# EAGLE design motordriver (EAGLE 7.6.0)
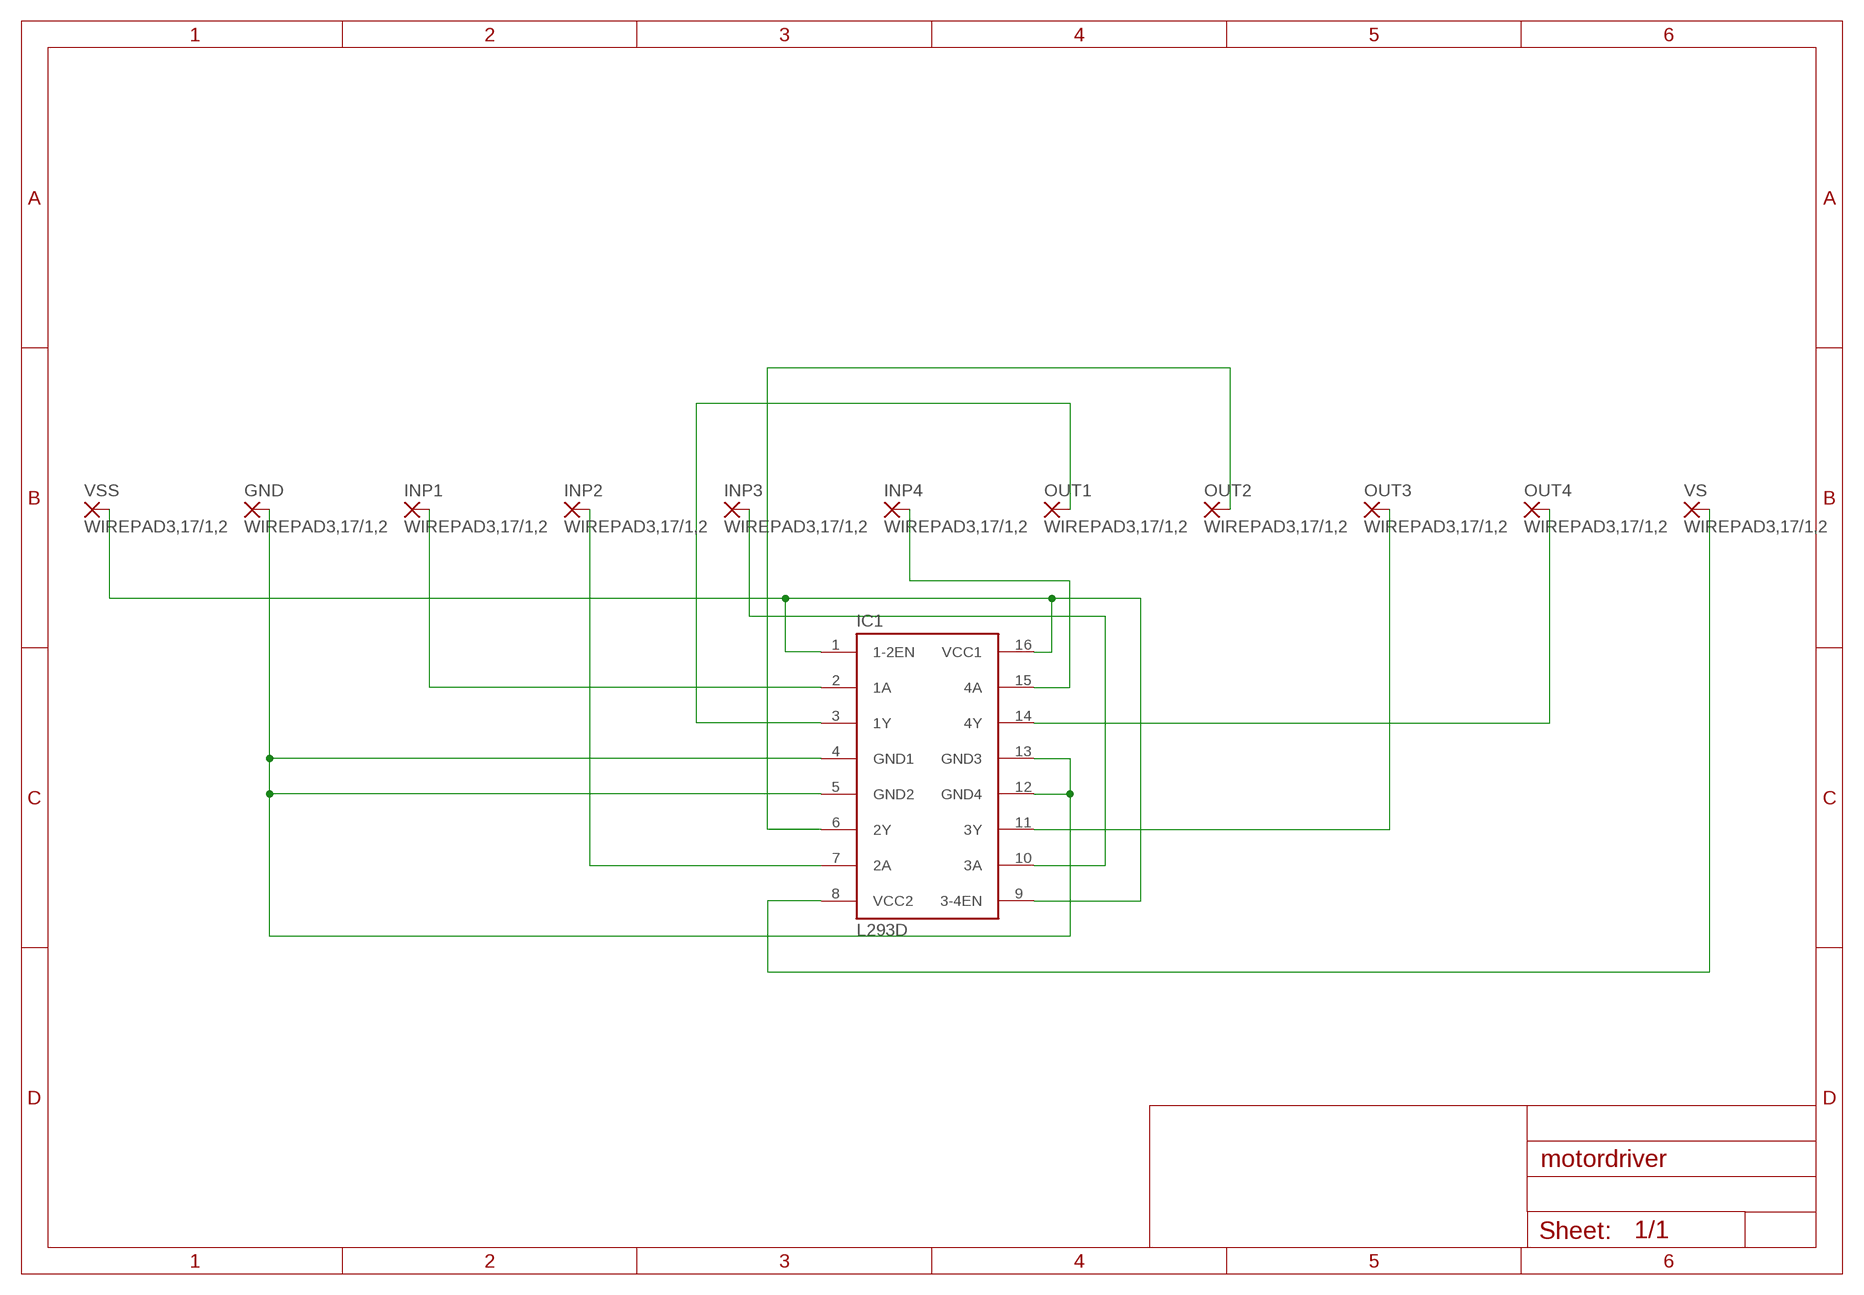
[diagram p0: schematic, sheet 1]

## Parts
GND  WIREPAD3,17/1,2  [3,17/1,2]
IC1  L293D  [DIL16]
INP1  WIREPAD3,17/1,2  [3,17/1,2]
INP2  WIREPAD3,17/1,2  [3,17/1,2]
INP3  WIREPAD3,17/1,2  [3,17/1,2]
INP4  WIREPAD3,17/1,2  [3,17/1,2]
OUT1  WIREPAD3,17/1,2  [3,17/1,2]
OUT2  WIREPAD3,17/1,2  [3,17/1,2]
OUT3  WIREPAD3,17/1,2  [3,17/1,2]
OUT4  WIREPAD3,17/1,2  [3,17/1,2]
VS  WIREPAD3,17/1,2  [3,17/1,2]
VSS  WIREPAD3,17/1,2  [3,17/1,2]

## Nets
N$1: IC1.8(VCC2) VS.1(P)
N$2: IC1.1(1-2EN) IC1.9(3-4EN) IC1.16(VCC1) VSS.1(P)
N$3: IC1.15(4A) INP4.1(P)
N$4: IC1.14(4Y) OUT4.1(P)
N$5: GND.1(P) IC1.4(GND1) IC1.5(GND2) IC1.12(GND4) IC1.13(GND3)
N$6: IC1.11(3Y) OUT3.1(P)
N$7: IC1.10(3A) INP3.1(P)
N$8: IC1.2(1A) INP1.1(P)
N$9: IC1.7(2A) INP2.1(P)
N$10: IC1.3(1Y) OUT1.1(P)
N$11: IC1.6(2Y) OUT2.1(P)

## Library data of the parts
GND INP1-INP4 OUT1-OUT4 VS VSS = wirepad:WIREPAD: Wire PAD connect wire on PCB
IC1 = st-microelectronics:L293D: PUSH-PULL 4 CHANNEL DRIVER; MPN: L293D; OC_FARNELL: 9589619; OC_NEWARK: 56P8249

## Board
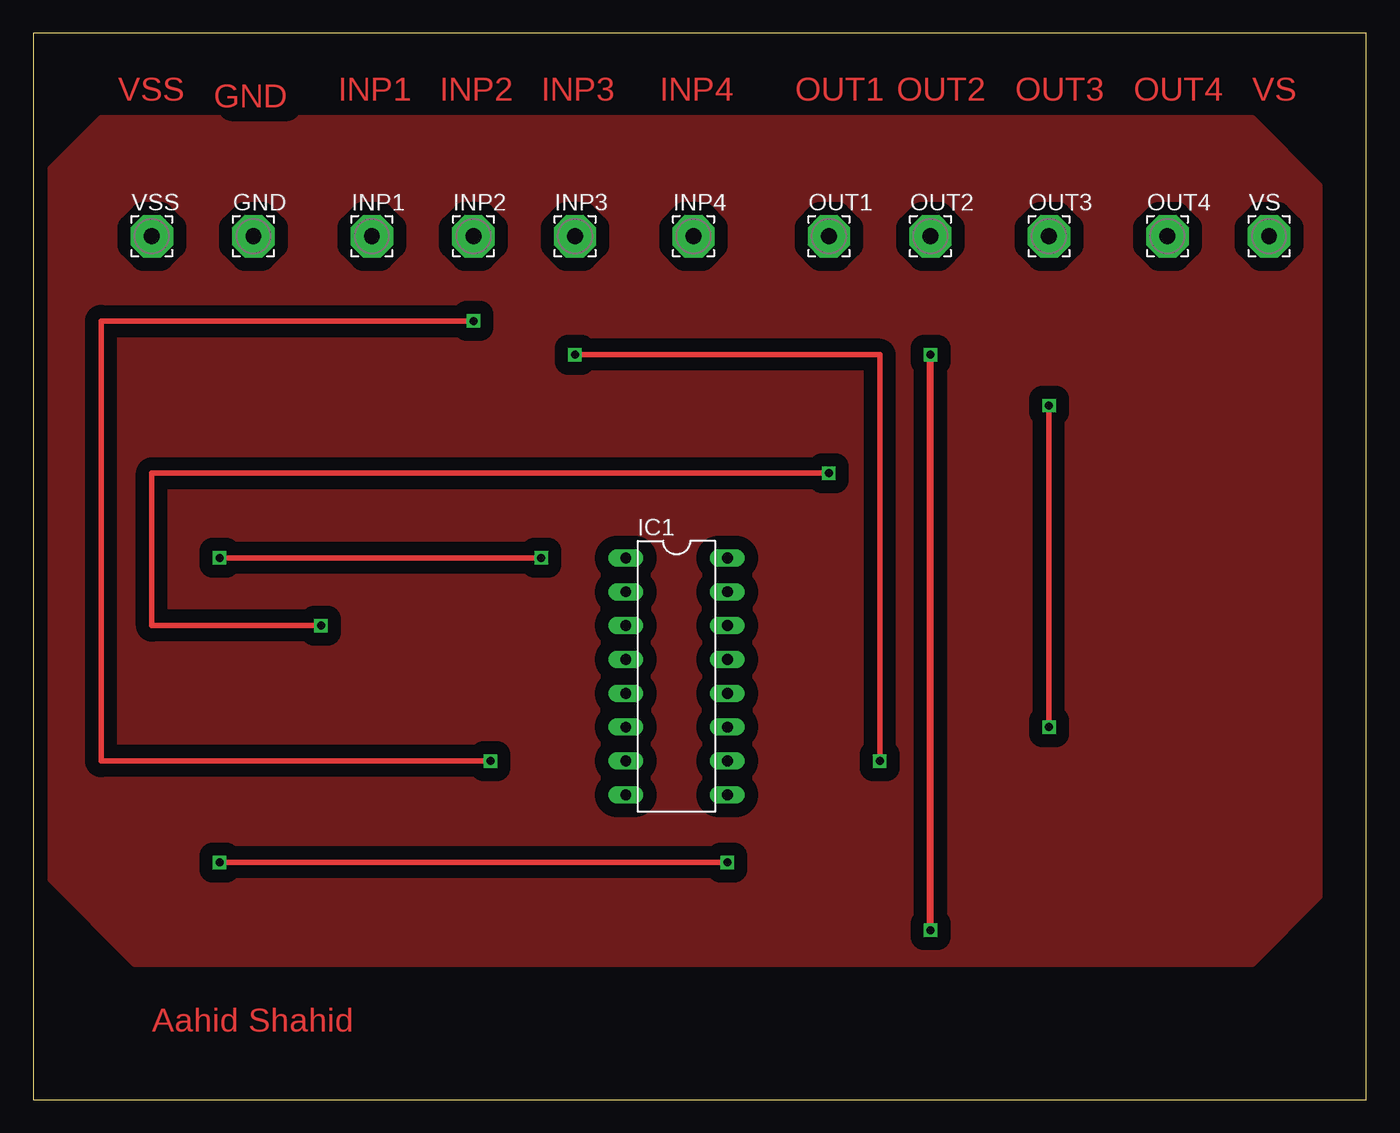
[diagram p1: board, top side]
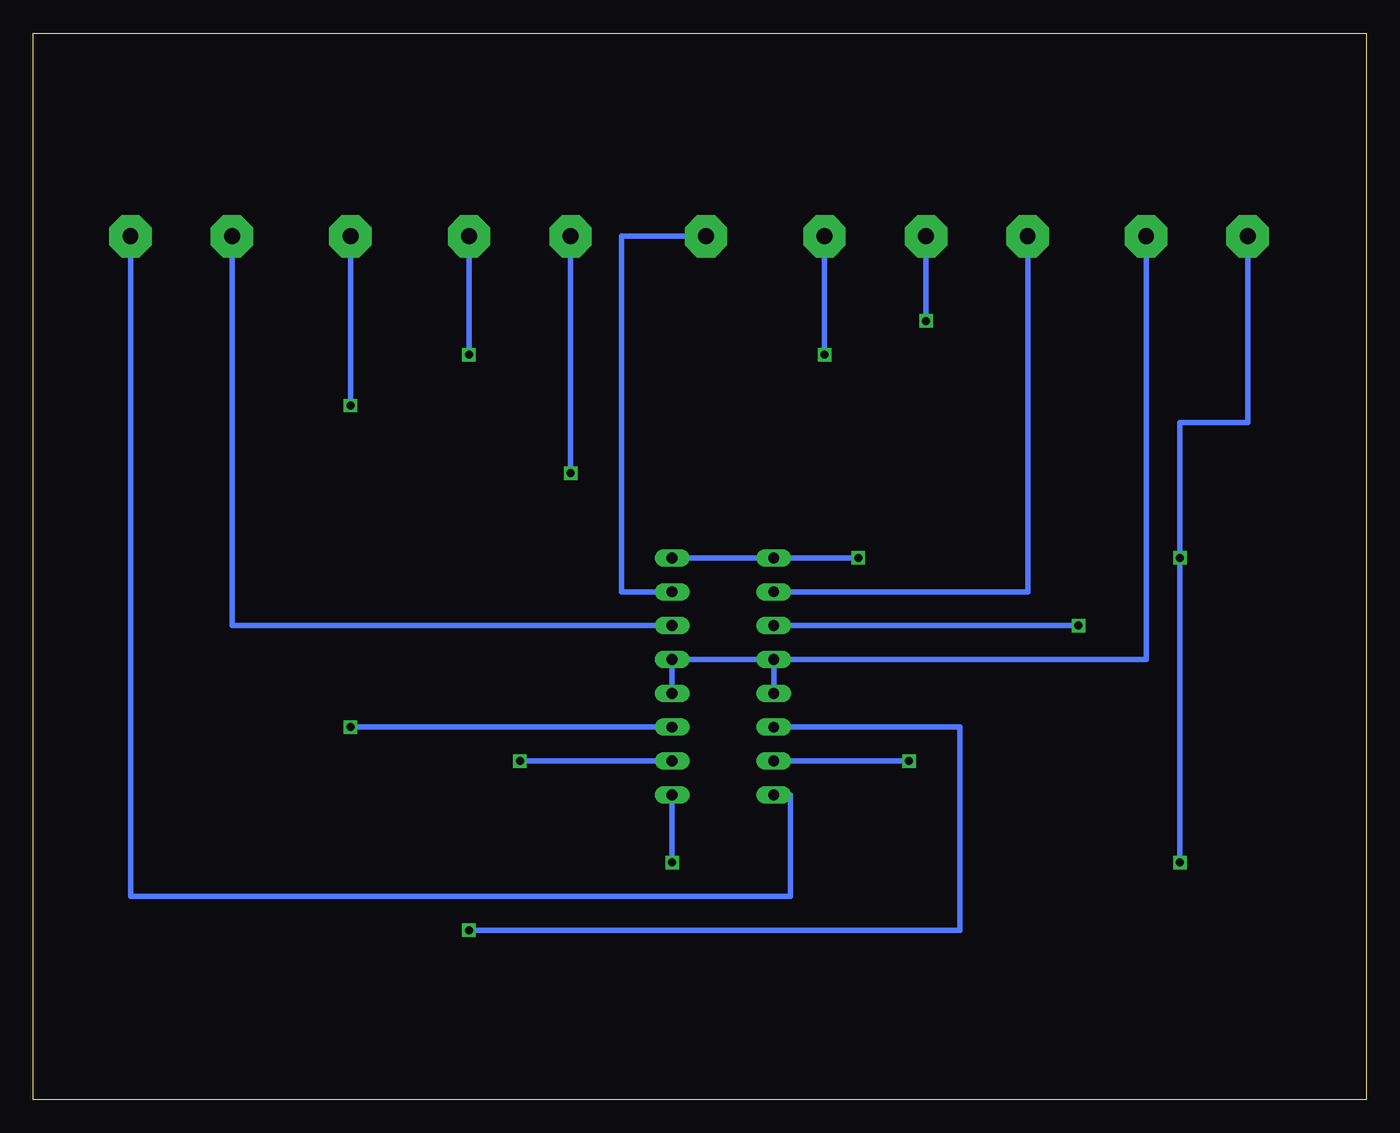
[diagram p2: board, bottom side, seen from below]

Size 100 x 80 mm. Coordinates in mm from the lower left corner, seen from the top.
Outline: 0,0 100,0 100,80 0,80 0,0
Copper layers (1*16): Top 0.035mm / dielectric 1.5mm / Bottom 0.035mm
Design rules "default *": minimum track width 0.6mm, minimum drill 0.1mm, track to track 1mm, track to pad 1mm, pad to pad 1mm, via to via 1mm, smd to smd 8mil, copper to edge 40mil, drill to drill 8mil, minimum pad ring 10mil, minimum via ring 8mil, stop-mask expansion 4mil, vias tented up to drill 0mil, thermal gap 10mil

### Footprints (pad centres in the part's own frame; a part is rotated, then mirrored left to right if it is on the bottom)
3,17/1,2 = drill 1.194 pad 3.175 octagon: 1 0,0
DIL16 = drill 0.813 long: 1 -8.89,-3.81; 2 -6.35,-3.81; 3 -3.81,-3.81; 4 -1.27,-3.81; 5 1.27,-3.81; 6 3.81,-3.81; 7 6.35,-3.81; 8 8.89,-3.81; 9 8.89,3.81; 10 6.35,3.81; 11 3.81,3.81; 12 1.27,3.81; 13 -1.27,3.81; 14 -3.81,3.81; 15 -6.35,3.81; 16 -8.89,3.81

### Placement (x,y rotation side)
GND  16.51,64.77 0 top
IC1  48.26,31.75 270 top
INP1  25.4,64.77 0 top
INP2  33.02,64.77 0 top
INP3  40.64,64.77 0 top
INP4  49.53,64.77 0 top
OUT1  59.69,64.77 0 top
OUT2  67.31,64.77 0 top
OUT3  76.2,64.77 0 top
OUT4  85.09,64.77 0 top
VS  92.71,64.77 0 top
VSS  8.89,64.77 0 top

### Tracks (layer width: path | path; a pad name or v marks a point on that pad's centre or on a via)
GND
  pour Top: 1.27,69.85 1.27,16.51 7.62,10.16 91.44,10.16 96.52,15.24 96.52,68.58 91.44,73.66 5.08,73.66
N$1
  Bottom 0.406: IC1.8 43.18,22.86 43.18,15.24 92.71,15.24 VS.1
N$2  (via drill 0.6)
  Top 0.406: v38.1,40.64 v13.97,40.64 | v52.07,17.78 v13.97,17.78
  Bottom 0.406: IC1.16 IC1.1 v38.1,40.64 | v13.97,17.78 v13.97,40.64 13.97,50.8 8.89,50.8 VSS.1 | IC1.9 v52.07,17.78
N$3
  Bottom 0.406: IC1.15 55.88,38.1 55.88,64.77 INP4.1
N$4
  Bottom 0.406: IC1.14 85.09,35.56 OUT4.1
N$5
  Bottom 0.406: IC1.4 IC1.5 | IC1.12 IC1.13 IC1.4 | IC1.4 16.51,33.02 GND.1
N$6  (via drill 0.6)
  Top 0.406: v76.2,27.94 v76.2,52.07
  Bottom 0.406: IC1.11 v76.2,27.94 | v76.2,52.07 OUT3.1
N$7  (via drill 0.6)
  Top 0.406: v63.5,25.4 63.5,55.88 v40.64,55.88
  Bottom 0.406: IC1.10 v63.5,25.4 | v40.64,55.88 INP3.1
N$8
  Bottom 0.406: IC1.2 25.4,38.1 INP1.1
N$9  (via drill 0.6)
  Top 0.406: v34.29,25.4 5.08,25.4 5.08,58.42 v33.02,58.42
  Bottom 0.406: IC1.7 v34.29,25.4 | v33.02,58.42 INP2.1
N$10  (via drill 0.6)
  Top 0.406: v21.59,35.56 8.89,35.56 8.89,46.99 v59.69,46.99
  Bottom 0.406: IC1.3 v21.59,35.56 | v59.69,46.99 OUT1.1
N$11  (via drill 0.6)
  Top 0.508: v67.31,12.7 v67.31,55.88
  Bottom 0.406: IC1.6 30.48,27.94 30.48,12.7 v67.31,12.7 | v67.31,55.88 OUT2.1

### Text on the board
Top: GND | VSS | INP1 | INP2 | INP3 | INP4 | OUT1 | OUT2 | OUT3 | OUT4 | VS | Aahid Shahid